# Altium schematic sheet ESP32_with_USBC.SchDoc
size A2; SheetNumber: 1; SheetTotal: 1
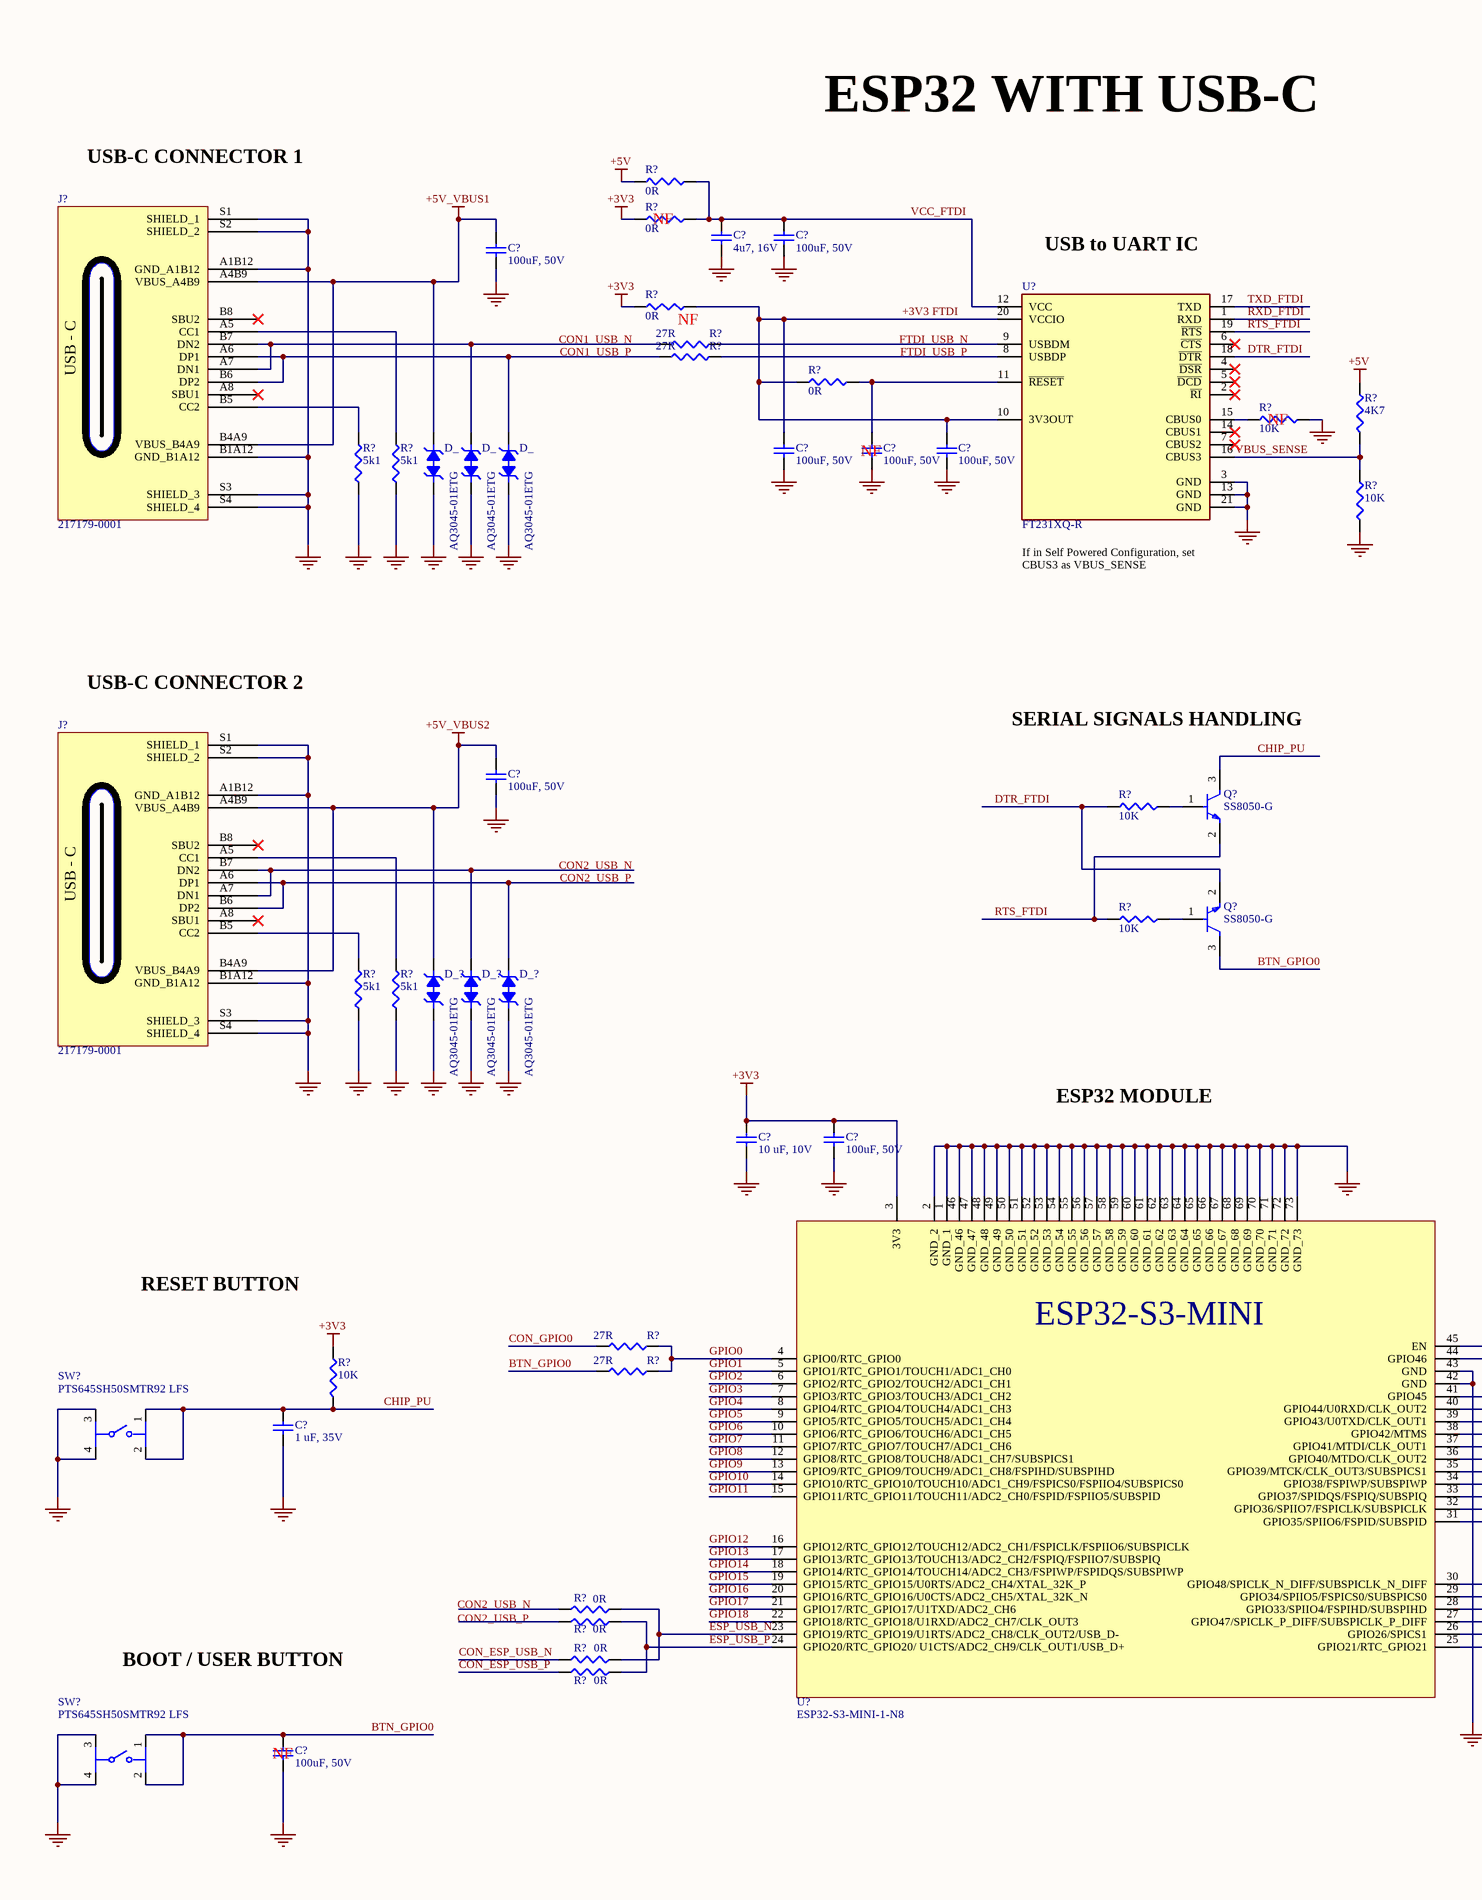
[diagram p0: ESP32_with_USBC.SchDoc, left]
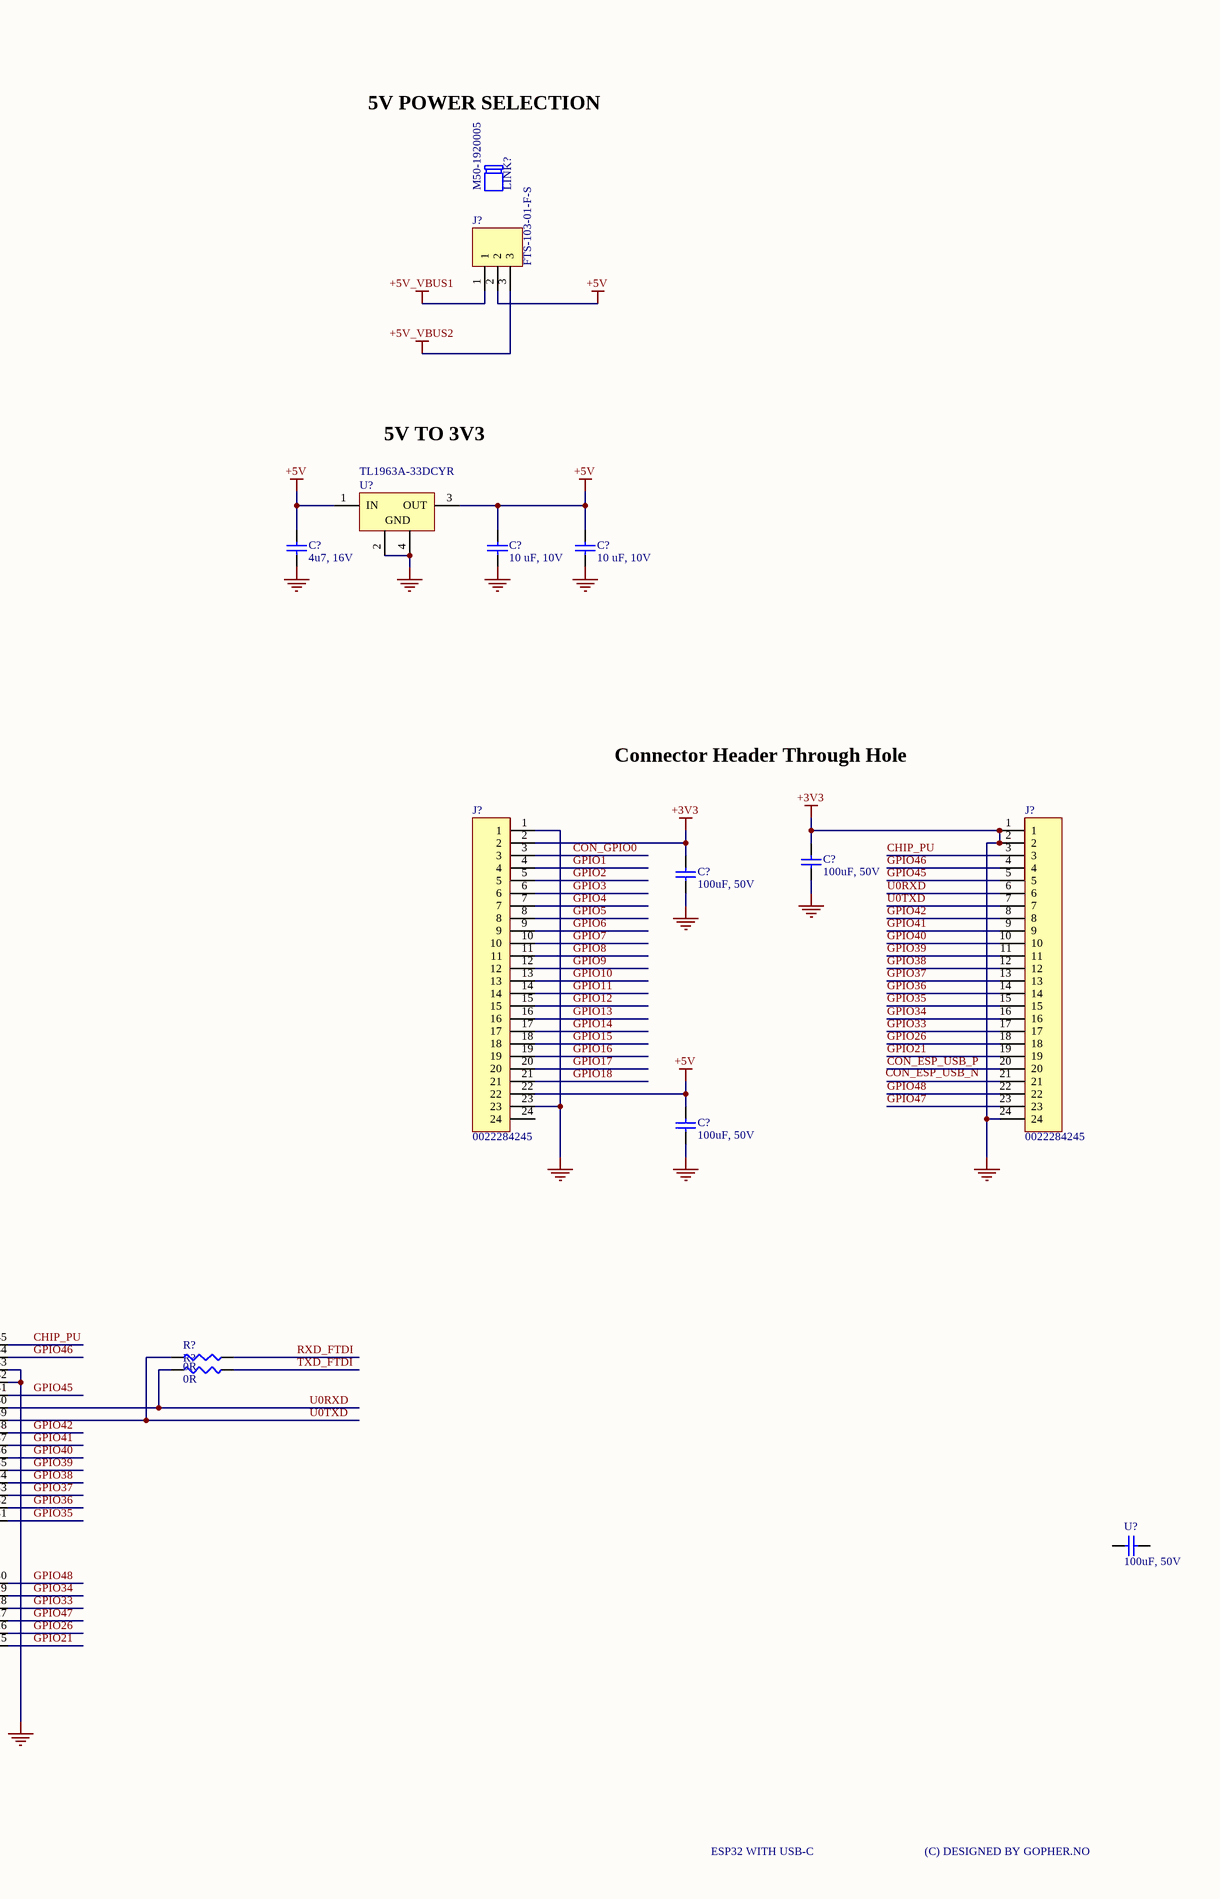
[diagram p1: ESP32_with_USBC.SchDoc, right]

## Parts
(Parts that share a designator on the sheet are numbered #1, #2 ... from top to bottom, then left to right.)
C?#1  4u7, 16V
C?#2  100uF, 50V
C?#3  100uF, 50V
C?#4  100uF, 50V
C?#5  100uF, 50V
C?#6  100uF, 50V
C?#7  4u7, 16V
C?#8  10 uF, 10V
C?#9  10 uF, 10V
C?#10  100uF, 50V
C?#11  100uF, 50V
C?#12  100uF, 50V
C?#13  100uF, 50V
C?#14  10 uF, 10V
C?#15  100uF, 50V
C?#16  1 uF, 35V
C?#17  100uF, 50V
D_#1  AQ3045-01ETG
D_#2  AQ3045-01ETG
D_#3  AQ3045-01ETG
D_?#1  AQ3045-01ETG
D_?#2  AQ3045-01ETG
D_?#3  AQ3045-01ETG
J?#1  217179-0001
J?#2  FTS-103-01-F-S
J?#3  217179-0001
J?#4  0022284245
J?#5  0022284245
LINK?  M50-1920005
Q?#1  SS8050-G
Q?#2  SS8050-G
R?#1  0R
R?#2  0R
R?#3  0R
R?#4  27R
R?#5  27R
R?#6  0R
R?#7  10K
R?#8  4K7
R?#9  5k1
R?#10  5k1
R?#11  10K
R?#12  10K
R?#13  10K
R?#14  5k1
R?#15  5k1
R?#16  10K
R?#17  27R
R?#18  0R
R?#19  27R
R?#20  0R
R?#21  0R
R?#22  0R
R?#23  0R
R?#24  0R
SW?#1  PTS645SH50SMTR92 LFS
SW?#2  PTS645SH50SMTR92 LFS
U?#1  FT231XQ-R
U?#2  TL1963A-33DCYR
U?#3  ESP32-S3-MINI-1-N8
U?#4  100uF, 50V

## Nets
+3V3: C?#1.1 C?#2.1 C?#3.1 C?#4.1 C?#5.1 C?#6.1 C?#7.1 C?#8.1 C?#9.1 C?#10.1 C?#11.1 C?#12.1 C?#13.1 C?#14.1 C?#14.2 C?#15.1 C?#16.2 C?#17.1 D_#1.2 D_#2.1 D_#3.1 D_?#1.2 D_?#2.1 D_?#3.1 J?#1.A1B12(GND_A1B12) J?#1.B1A12(GND_B1A12) J?#1.S1(SHIELD_1) J?#1.S2(SHIELD_2) J?#1.S3(SHIELD_3) J?#1.S4(SHIELD_4) J?#3.A1B12(GND_A1B12) J?#3.B1A12(GND_B1A12) J?#3.S1(SHIELD_1) J?#3.S2(SHIELD_2) J?#3.S3(SHIELD_3) J?#3.S4(SHIELD_4) J?#4.1 J?#4.2 J?#4.23 J?#5.1 J?#5.2 J?#5.24 R?#2.1 R?#3.1 R?#7.1 R?#9.1 R?#10.1 R?#11.1 R?#14.1 R?#15.1 R?#16.1 SW?#1.3 SW?#1.4 SW?#2.3 SW?#2.4 U?#1.3(GND) U?#1.13(GND) U?#1.21(GND) U?#2.2(GND) U?#2.4(GND) U?#3.1(GND_1) U?#3.2(GND_2) U?#3.3(3V3) U?#3.42(GND) U?#3.43(GND) U?#3.46(GND_46) U?#3.47(GND_47) U?#3.48(GND_48) U?#3.49(GND_49) U?#3.50(GND_50) U?#3.51(GND_51) U?#3.52(GND_52) U?#3.53(GND_53) U?#3.54(GND_54) U?#3.55(GND_55) U?#3.56(GND_56) U?#3.57(GND_57) U?#3.58(GND_58) U?#3.59(GND_59) U?#3.60(GND_60) U?#3.61(GND_61) U?#3.62(GND_62) U?#3.63(GND_63) U?#3.64(GND_64) U?#3.65(GND_65) U?#3.66(GND_66) U?#3.67(GND_67) U?#3.68(GND_68) U?#3.69(GND_69) U?#3.70(GND_70) U?#3.71(GND_71) U?#3.72(GND_72) U?#3.73(GND_73)  [also labelled GND]
+5V: C?#7.2 C?#8.2 C?#9.2 C?#13.1 J?#2.2 J?#4.22 R?#1.1 R?#8.2 U?#2.1(IN) U?#2.3(OUT)
+5V_VBUS1: C?#3.1 D_#2.2 J?#1.A4B9(VBUS_A4B9) J?#1.B4A9(VBUS_B4A9) J?#2.1
+5V_VBUS2: C?#10.1 D_?#2.2 J?#2.3 J?#3.A4B9(VBUS_A4B9) J?#3.B4A9(VBUS_B4A9)
+3V3 FTDI: C?#4.1 C?#6.1 R?#3.2 R?#6.1 U?#1.10(3V3OUT) U?#1.20(VCCIO)
BTN_GPIO0: C?#17.1 SW?#2.1 SW?#2.2
CHIP_PU: C?#16.1 J?#5.3 Q?#1.3(C) R?#16.2 SW?#1.1 SW?#1.2 U?#3.45(EN)
CON_ESP_USB_N: R?#23.1
CON_ESP_USB_P: J?#5.20 R?#24.1
DTR_FTDI: Q?#2.2(E) R?#12.1 U?#1.18(~{DTR})
ESP_USB_N: R?#21.2 R?#23.2 U?#3.23(GPIO19/RTC_GPIO19/U1RTS/ADC2_CH8/CLK_OUT2/USB_D-)
ESP_USB_P: R?#22.2 R?#24.2 U?#3.24(GPIO20/RTC_GPIO20/_U1CTS/ADC2_CH9/CLK_OUT1/USB_D+)
GPIO0: R?#17.2 R?#19.2 U?#3.4(GPIO0/RTC_GPIO0)
GPIO1: J?#4.4 U?#3.5(GPIO1/RTC_GPIO1/TOUCH1/ADC1_CH0)
GPIO2: J?#4.5 U?#3.6(GPIO2/RTC_GPIO2/TOUCH2/ADC1_CH1)
GPIO3: J?#4.6 U?#3.7(GPIO3/RTC_GPIO3/TOUCH3/ADC1_CH2)
GPIO4: J?#4.7 U?#3.8(GPIO4/RTC_GPIO4/TOUCH4/ADC1_CH3)
GPIO5: J?#4.8 U?#3.9(GPIO5/RTC_GPIO5/TOUCH5/ADC1_CH4)
GPIO6: J?#4.9 U?#3.10(GPIO6/RTC_GPIO6/TOUCH6/ADC1_CH5)
GPIO7: J?#4.10 U?#3.11(GPIO7/RTC_GPIO7/TOUCH7/ADC1_CH6)
GPIO8: J?#4.11 U?#3.12(GPIO8/RTC_GPIO8/TOUCH8/ADC1_CH7/SUBSPICS1)
GPIO9: J?#4.12 U?#3.13(GPIO9/RTC_GPIO9/TOUCH9/ADC1_CH8/FSPIHD/SUBSPIHD)
GPIO10: J?#4.13 U?#3.14(GPIO10/RTC_GPIO10/TOUCH10/ADC1_CH9/FSPICS0/FSPIIO4/SUBSPICS0)
GPIO11: J?#4.14 U?#3.15(GPIO11/RTC_GPIO11/TOUCH11/ADC2_CH0/FSPID/FSPIIO5/SUBSPID)
GPIO12: J?#4.15 U?#3.16(GPIO12/RTC_GPIO12/TOUCH12/ADC2_CH1/FSPICLK/FSPIIO6/SUBSPICLK)
GPIO13: J?#4.16 U?#3.17(GPIO13/RTC_GPIO13/TOUCH13/ADC2_CH2/FSPIQ/FSPIIO7/SUBSPIQ)
GPIO14: J?#4.17 U?#3.18(GPIO14/RTC_GPIO14/TOUCH14/ADC2_CH3/FSPIWP/FSPIDQS/SUBSPIWP)
GPIO15: J?#4.18 U?#3.19(GPIO15/RTC_GPIO15/U0RTS/ADC2_CH4/XTAL_32K_P)
GPIO16: J?#4.19 U?#3.20(GPIO16/RTC_GPIO16/U0CTS/ADC2_CH5/XTAL_32K_N)
GPIO17: J?#4.20 U?#3.21(GPIO17/RTC_GPIO17/U1TXD/ADC2_CH6)
GPIO18: J?#4.21 U?#3.22(GPIO18/RTC_GPIO18/U1RXD/ADC2_CH7/CLK_OUT3)
GPIO21: J?#5.19 U?#3.25(GPIO21/RTC_GPIO21)
GPIO26: J?#5.18 U?#3.26(GPIO26/SPICS1)
GPIO33: J?#5.17 U?#3.28(GPIO33/SPIIO4/FSPIHD/SUBSPIHD)
GPIO34: J?#5.16 U?#3.29(GPIO34/SPIIO5/FSPICS0/SUBSPICS0)
GPIO35: J?#5.15 U?#3.31(GPIO35/SPIIO6/FSPID/SUBSPID)
GPIO36: J?#5.14 U?#3.32(GPIO36/SPIIO7/FSPICLK/SUBSPICLK)
GPIO37: J?#5.13 U?#3.33(GPIO37/SPIDQS/FSPIQ/SUBSPIQ)
GPIO38: J?#5.12 U?#3.34(GPIO38/FSPIWP/SUBSPIWP)
GPIO39: J?#5.11 U?#3.35(GPIO39/MTCK/CLK_OUT3/SUBSPICS1)
GPIO40: J?#5.10 U?#3.36(GPIO40/MTDO/CLK_OUT2)
GPIO41: J?#5.9 U?#3.37(GPIO41/MTDI/CLK_OUT1)
GPIO42: J?#5.8 U?#3.38(GPIO42/MTMS)
GPIO45: J?#5.5 U?#3.41(GPIO45)
GPIO46: J?#5.4 U?#3.44(GPIO46)
GPIO47: J?#5.23 U?#3.27(GPIO47/SPICLK_P_DIFF/SUBSPICLK_P_DIFF)
GPIO48: J?#5.22 U?#3.30(GPIO48/SPICLK_N_DIFF/SUBSPICLK_N_DIFF)
RTS_FTDI: Q?#1.2(E) R?#13.1 U?#1.19(~{RTS})
RXD_FTDI: R?#18.2 U?#1.1(RXD)
TXD_FTDI: R?#20.2 U?#1.17(TXD)
U0RXD: J?#5.6 R?#20.1 U?#3.40(GPIO44/U0RXD/CLK_OUT2)
U0TXD: J?#5.7 R?#18.1 U?#3.39(GPIO43/U0TXD/CLK_OUT1)
VBUS_SENSE: R?#8.1 R?#11.2 U?#1.16(CBUS3)
NetC?#1_2: C?#1.2 C?#2.1 R?#1.2 R?#2.2 U?#1.12(VCC)
NetC?#5_1: C?#5.1 R?#6.2 U?#1.11(~{RESET})
NetD_#1_1: D_#1.1 J?#1.A7(DN1) J?#1.B7(DN2) R?#4.1
NetD_#3_2: D_#3.2 J?#1.A6(DP1) J?#1.B6(DP2) R?#5.1
NetD_?#1_1: D_?#1.1 J?#3.A7(DN1) J?#3.B7(DN2)
NetD_?#3_2: D_?#3.2 J?#3.A6(DP1) J?#3.B6(DP2)
NetJ?#1_A5: J?#1.A5(CC1) R?#10.2
NetJ?#1_B5: J?#1.B5(CC2) R?#9.2
NetJ?#3_A5: J?#3.A5(CC1) R?#15.2
NetJ?#3_B5: J?#3.B5(CC2) R?#14.2
NetQ?#1_1: Q?#1.1(B) R?#12.2
NetQ?#2_1: Q?#2.1(B) R?#13.2
NetR?#4_2: R?#4.2 U?#1.9(USBDM)
NetR?#5_2: R?#5.2 U?#1.8(USBDP)
NetR?#7_2: R?#7.2 U?#1.15(CBUS0)

Not connected (* = marked no-connect by the designer): J?#1 A8(SBU1)* B8(SBU2)*; J?#3 A8(SBU1)* B8(SBU2)*; J?#4 3 24; J?#5 21; Q?#2 3(C); R?#17 1; R?#19 1; R?#21 1; R?#22 1; U?#1 2(~{RI})* 4(~{DSR})* 5(~{DCD})* 6(~{CTS})* 7(CBUS2)* 14(CBUS1)*; U?#4 1

## Notes on the sheet
- ESP32 WITH USB-C
- 5V POWER SELECTION
- USB-C CONNECTOR 1
- (near R?#2) NF
- USB to UART IC
- (near R?#3) CON1_USB_N
- (near R?#3) CON1_USB_P
- (near R?#3) NF
- FTDI_USB_N
- FTDI_USB_P
- (near R?#7) NF
- 5V TO 3V3
- (near C?#5) NF
- (near U?#1) If in Self Powered Configuration, set CBUS3 as VBUS_SENSE
- USB-C CONNECTOR 2
- SERIAL SIGNALS HANDLING
- Connector Header Through Hole
- CON2_USB_N
- CON2_USB_P
- CON_GPIO0
- (near Q?#2) BTN_GPIO0
- ESP32 MODULE
- RESET BUTTON
- (near R?#17) CON_GPIO0
- (near R?#19) BTN_GPIO0
- (near R?#22) CON2_USB_P
- (near R?#21) CON2_USB_N
- BOOT / USER BUTTON
- (near C?#17) NF
- (C) DESIGNED BY GOPHER.NO
- Labels drawn without touching a wire or pin: CON_ESP_USB_N, VCC_FTDI
- (in symbol 217179-0001) USB - C
- (in symbol ESP32-S3-MINI-1-N8) ESP32-S3-MINI

## Library data of the parts
C?#1 C?#7 = CC0402MRX5R7BB475: Ceramic Capacitor, Multilayer, Ceramic, 16V, 20% +Tol, 20% -Tol, X5R, 15% TC, 4.7uF, Surface Mount, 0402, 4.7 µF ±20% 16V Ceramic Capacitor X5R 0402 (1005 Metric),13-CC0402MRX5R7BB475CT-ND; Manufacturer: Yageo; Multilayer: Yes; Supplier: Digikey; Supplier Part Number: 13-CC0402MRX5R7BB475CT-ND; Manufacturer Part Number: CC0402MRX5R7BB475; RoHS: Yes; Category: Ceramic Capacitors; Stock: 23634; Pricing: 1=0,5, 10=0,303, 100=0,1868, 1000=0,15196, 2500=0,1316, 5000=0,13053 (USD); Mounting Technology: Surface Mount; Pins: 2; Dielectric Material: Ceramic; Package Shape: Rectangular; Case/Package: 0402; Terminal Finish: Tin; Min Operating Temperature: -55°C; Max Operating Temperature: 85°C; JESD-609 Code: e3; Value: 4.7uF; Capacitor Type: Ceramic; Tolerance  (fill in as +-): 20%; Packaging: Tape and Reel; Tolerance (fill in as +-): 20%; Rated DC Voltage (URdc): 16V; Temperature Characteristics Code: X5R; Termination: Wraparound; Reach SVHC Compliant: Yes; RoHS Compliant: Yes; ComponentLink1URL: https://datasheet.ciiva.com:443/pdfs/VipMasterIC/IC/YAGO/YAGO-S-A0006851646/YAGO-S-A0006851646-1.pdf?src-supplier=IHS+Markit; ComponentLink1Description: https://datasheet.ciiva.com:443/pdfs/VipMasterIC/IC/YAGO/YAGO-S-A0006851646/YAGO-S-A0006851646-1.pdf?src-supplier=IHS+Markit; ComponentLink2URL: https://www.mouser.com/ds/2/447/UPY-GPHC_X5R_4V-to-50V_25-1131599.pdf?src-supplier=Mouser; ComponentLink2Description: https://www.mouser.com/ds/2/447/UPY-GPHC_X5R_4V-to-50V_25-1131599.pdf?src-supplier=Mouser; ComponentLink3URL: http://www.yageo.com/documents/recent/UPY-GPHC_X5R_4V-to-50V_25.pdf?src-supplier=Digikey; ComponentLink3Description: http://www.yageo.com/documents/recent/UPY-GPHC_X5R_4V-to-50V_25.pdf?src-supplier=Digikey; ComponentLink4URL: https://www.yageo.com/upload/media/product/productsearch/datasheet/mlcc/UPY-GPHC_X5R_4V-to-50V_26.pdf?src-supplier=Digikey; ComponentLink4Description: https://www.yageo.com/upload/media/product/productsearch/datasheet/mlcc/UPY-GPHC_X5R_4V-to-50V_26.pdf?src-supplier=Digikey; LCSC Part Number: C723999
C?#2-C?#6 C?#10-C?#13 C?#15 C?#17 U?#4 = GCM155R71H104KE02D: Ceramic Capacitor, Ceramic, 50V, 10% +Tol, 10% -Tol, X7R, 15% TC, 0.1uF, Surface Mount, 0402, CAP CER 0.1UF 50V X7R 0402; Manufacturer: Murata; Value: 100nF; Multilayer: Yes; Reference Standard: AEC-Q200; Supplier: Digikey; Supplier Part Number: 490-10672-1-ND; Manufacturer Part Number: GCM155R71H104KE02D; RoHS: Yes; Category: Ceramic Capacitors; Stock: 712609; Pricing: 1=0,1, 10=0,027, 100=0,0166, 1000=0,01117, 2500=0,00972, 5000=0,00881 (USD); Mounting Technology: Surface Mount; Pins: 2; Dielectric Material: Ceramic; Package Shape: Rectangular; Case/Package: 0402; Terminal Finish: Nickel; Min Operating Temperature: -55°C; Max Operating Temperature: 125°C; JESD-609 Code: e3; Capacitor Type: Ceramic; Tolerance  (fill in as +-): 10%; Package Style: SMTMeter; Packaging: Tape and Reel; Tolerance (fill in as +-): 10%; Rated DC Voltage (URdc): 50V; Temperature Characteristics Code: X7R; Termination: Wraparound; Length: 1mm; Width: 0.5mm; Height: 0.55mm; Reach SVHC Compliant: Yes; RoHS Compliant: Yes; ComponentLink1URL: https://datasheet.ciiva.com:443/pdfs/VipMasterIC/IC/MURE/MURE-S-A0004370842/MURE-S-A0004373200-1.pdf?src-supplier=IHS+Markit; ComponentLink1Description: https://datasheet.ciiva.com:443/pdfs/VipMasterIC/IC/MURE/MURE-S-A0004370842/MURE-S-A0004373200-1.pdf?src-supplier=IHS+Markit; ComponentLink2URL: http://www.farnell.com/datasheets/2079122.pdf?src-supplier=Farnell; ComponentLink2Description: http://www.farnell.com/datasheets/2079122.pdf?src-supplier=Farnell; ComponentLink3URL: http://www.mouser.com/ds/2/281/c03e-806517.pdf?src-supplier=Mouser; ComponentLink3Description: http://www.mouser.com/ds/2/281/c03e-806517.pdf?src-supplier=Mouser; ComponentLink4URL: http://www.farnell.com/datasheets/2079122.pdf?src-supplier=Element14; ComponentLink4Description: http://www.farnell.com/datasheets/2079122.pdf?src-supplier=Element14; ComponentLink5URL: https://datasheet.octopart.com/GCM155R71H104KE02D-Murata-datasheet-66077033.pdf?src-supplier=Element14; ComponentLink5Description: https://datasheet.octopart.com/GCM155R71H104KE02D-Murata-datasheet-66077033.pdf?src-supplier=Element14; ComponentLink6URL: http://search.murata.co.jp/Ceramy/image/img/A01X/partnumbering_e_02.pdf?src-supplier=Digikey; ComponentLink6Description: http://search.murata.co.jp/Ceramy/image/img/A01X/partnumbering_e_02.pdf?src-supplier=Digikey; LCSC Part Number: C85858
C?#8 C?#9 C?#14 = CL05A106MP8NUB8: Ceramic Capacitor, Multilayer, Ceramic, 10V, 20% +Tol, 20% -Tol, X5R, 15% TC, 10uF, Surface Mount, 0402, CAP CER 10UF 10V X5R 0402; Manufacturer: Samsung; Multilayer: Yes; Supplier: Digikey; Supplier Part Number: 1276-6830-1-ND; Manufacturer Part Number: CL05A106MP8NUB8; RoHS: Yes; Category: Ceramic Capacitors; Stock: 35446; Pricing: 1=0,25, 10=0,15, 100=0,1008, 1000=0,0704, 2500=0,0576 (USD); Mounting Technology: Surface Mount; Pins: 2; Dielectric Material: Ceramic; Package Shape: Rectangular; Case/Package: 0402; Terminal Finish: Nickel; Min Operating Temperature: -55°C; Max Operating Temperature: 85°C; JESD-609 Code: e3; Value: 10uF; Capacitor Type: Ceramic; Tolerance  (fill in as +-): 20%; Packaging: Tape and Reel; Tolerance (fill in as +-): 20%; Rated DC Voltage (URdc): 10V; Temperature Characteristics Code: X5R; Termination: Wraparound; Reach SVHC Compliant: Yes; RoHS Compliant: Yes; ComponentLink1URL: https://datasheet.ciiva.com:443/pdfs/VipMasterIC/IC/SEMS/SEMS-S-A0008521219/SEMS-S-A0008521325-1.pdf?src-supplier=IHS+Markit; ComponentLink1Description: https://datasheet.ciiva.com:443/pdfs/VipMasterIC/IC/SEMS/SEMS-S-A0008521219/SEMS-S-A0008521325-1.pdf?src-supplier=IHS+Markit; ComponentLink2URL: http://www.samsungsem.com/kr/support/product-search/mlcc/CL05A106MP8NUB8.jsp?src-supplier=Digikey; ComponentLink2Description: http://www.samsungsem.com/kr/support/product-search/mlcc/CL05A106MP8NUB8.jsp?src-supplier=Digikey; ComponentLink3URL: https://datasheet.octopart.com/CL05A106MP8NUB8-Samsung-Electro-Mechanics-datasheet-136460857.pdf?src-supplier=Future+Electronics; ComponentLink3Description: https://datasheet.octopart.com/CL05A106MP8NUB8-Samsung-Electro-Mechanics-datasheet-136460857.pdf?src-supplier=Future+Electronics; LCSC Part Number: C307415
C?#16 = CL05A105KL5NRNC: Ceramic Capacitor, Multilayer, Ceramic, 35V, 10% +Tol, 10% -Tol, X5R, 15% TC, 1uF, Surface Mount, 0402, CAP CER 1UF 35V X5R 0402; Manufacturer: Samsung; Multilayer: Yes; Supplier: Digikey; Supplier Part Number: 1276-6796-1-ND; Manufacturer Part Number: CL05A105KL5NRNC; RoHS: Yes; Category: Ceramic Capacitors; Stock: 194941; Pricing: 1=0,29, 10=0,17, 100=0,1097, 1000=0,07829, 2500=0,06853, 5000=0,06578 (USD); Mounting Technology: Surface Mount; Pins: 2; Dielectric Material: Ceramic; Package Shape: Rectangular; Case/Package: 0402; Terminal Finish: Nickel; Min Operating Temperature: -55°C; Max Operating Temperature: 85°C; JESD-609 Code: e3; Value: 1uF; Capacitor Type: Ceramic; Tolerance  (fill in as +-): 10%; Packaging: Tape and Reel; Tolerance (fill in as +-): 10%; Rated DC Voltage (URdc): 35V; Temperature Characteristics Code: X5R; Termination: Wraparound; Reach SVHC Compliant: Yes; RoHS Compliant: Yes; ComponentLink1URL: https://datasheet.ciiva.com:443/pdfs/VipMasterIC/IC/SEMS/SEMS-S-A0008384515/SEMS-S-A0008872905-1.pdf?src-supplier=IHS+Markit; ComponentLink1Description: https://datasheet.ciiva.com:443/pdfs/VipMasterIC/IC/SEMS/SEMS-S-A0008384515/SEMS-S-A0008872905-1.pdf?src-supplier=IHS+Markit; ComponentLink2URL: http://www.samsungsem.com/kr/support/product-search/mlcc/CL05A105KL5NRNC.jsp?src-supplier=Digikey; ComponentLink2Description: http://www.samsungsem.com/kr/support/product-search/mlcc/CL05A105KL5NRNC.jsp?src-supplier=Digikey; LCSC Part Number: C307413
D_#1-D_#3 D_?#1-D_?#3 = AQ3045-01ETG: Trans Voltage Suppressor Diode, 40W, 5.3V V(RWM), Bidirectional, 1 Element, Silicon, MO-236, TVS DIODE 5.3VWM 12VC SOD882g; Manufacturer: Littelfuse; Package Body Material: Plastic; Max Breakdown Voltage: 9V; Min Breakdown Voltage: 6.8V; Number of Elements: 1; Reference Standard: AEC-Q101; Supplier: Digikey; Supplier Part Number: F9321CT-ND; Manufacturer Part Number: AQ3045-01ETG; RoHS: Yes; Category: TVS Diodes; Stock: 12011; Pricing: 1=0,46, 10=0,302, 100=0,141, 500=0,134, 1000=0,127, 2000=0,1255, 5000=0,124 (USD); Pins: 2; Diode Element Material: SILICON; Package Shape: Rectangular; Min Operating Temperature: -55°C; Max Operating Temperature: 150°C; Polarity: Bidirectional; Diode Type: TRANS VOLTAGE SUPPRESSOR; Non-rep Peak Rev Power Dis-Max: 40W; Package Style: CHIP CARRIERMeter; Rep Pk Reverse Voltage-Max: 5.3V; Surface Mount: Yes; Technology: AVALANCHE; Terminal Form: No Lead; Terminal Position: BOTTOM; Reach SVHC Compliant: Yes; RoHS Compliant: Yes; ComponentLink1URL: https://datasheet.ciiva.com:443/pdfs/VipMasterIC/IC/LFSI/LFSI-S-A0007892042/LFSI-S-A0007892042-1.pdf?src-supplier=IHS+Markit; ComponentLink1Description: https://datasheet.ciiva.com:443/pdfs/VipMasterIC/IC/LFSI/LFSI-S-A0007892042/LFSI-S-A0007892042-1.pdf?src-supplier=IHS+Markit; ComponentLink2URL: https://www.littelfuse.com/~/media/electronics/datasheets/tvs_diode_arrays/littelfuse_tvs_diode_array_aq3045_datasheet.pdf.pdf?src-supplier=Digikey; ComponentLink2Description: https://www.littelfuse.com/~/media/electronics/datasheets/tvs_diode_arrays/littelfuse_tvs_diode_array_aq3045_datasheet.pdf.pdf?src-supplier=Digikey; ComponentLink3URL: http://www.littelfuse.com/~/media/electronics/datasheets/tvs_diode_arrays/littelfuse_tvs_diode_array_aq3045_datasheet.pdf.pdf?src-supplier=Digikey; ComponentLink3Description: http://www.littelfuse.com/~/media/electronics/datasheets/tvs_diode_arrays/littelfuse_tvs_diode_array_aq3045_datasheet.pdf.pdf?src-supplier=Digikey; LCSC Part Number: C3710326
J?#1 J?#3 = 217179-0001: USB Connector, 16 Contact(s), Female, Right Angle, Surface Mount Terminal, Locking, Receptacle, CONN RCP USB2.0 TYP C 24P SMD RA; Manufacturer: Molex; Supplier: Digikey; Supplier Part Number: 900-2171790001CT-ND; Manufacturer Part Number: 217179-0001; RoHS: No; Category: Connectors; Stock: 522; Pricing: 1=0,79, 10=0,645, 25=0,5948, 50=0,5594, 100=0,5259, 250=0,48484, 500=0,45592 (USD); LCSC Part Number: C3197684
J?#2 = FTS-103-01-F-S: Board Connector, 3 Contact(s), 1 Row(s), Male, Straight, Solder Terminal, CONN HEADER VERT 3POS 1.27MM; Manufacturer: Samtec; Manufacturer Series: FTS; Option: General Purpose; Additional Feature: Low Profile; Filter Feature: No; Number of Rows Loaded: 1; Number of Contacts: 3; Supplier: Digikey; Supplier Part Number: 612-FTS-103-01-F-S-ND; Manufacturer Part Number: FTS-103-01-F-S; RoHS: Yes; Category: Connectors; Stock: 1829; Pricing: 1=0,73, 50=0,6378, 100=0,5407, 500=0,4491, 1000=0,38362, 2000=0,31431, 5000=0,2478, 10000=0,228 (USD); Mounting Technology: Board; Contact Material: Bronze; Contact Finish - Mating: GOLD (3) OVER NICKEL (50); Contact Finish - Termination: Matte Tin (Sn) - with Nickel (Ni) barrier; Connector Type: BOARD CONNECTOR; JESD-609 Code: e3; Contact Gender: Male; Mixed Contacts: No; Mounting Style: STRAIGHT; Termination: Solder; Terminal Pitch: 1.27mm; Flammability Rating: UL94 V-0; DIN Conformance: No; IEC Conformance: No; MIL Conformance: No; Reach SVHC Compliant: Yes; RoHS Compliant: Yes; ComponentLink1URL: https://datasheet.ciiva.com:443/pdfs/VipMasterIC/IC/SAMI/SAMI-S-A0001504673/SAMI-S-A0001504673-1.pdf?src-supplier=IHS+Markit; ComponentLink1Description: https://datasheet.ciiva.com:443/pdfs/VipMasterIC/IC/SAMI/SAMI-S-A0001504673/SAMI-S-A0001504673-1.pdf?src-supplier=IHS+Markit; ComponentLink2URL: http://suddendocs.samtec.com/prints/fts-1xx-xx-xx-xx-xx-mkt.pdf?src-supplier=Digikey; ComponentLink2Description: http://suddendocs.samtec.com/prints/fts-1xx-xx-xx-xx-xx-mkt.pdf?src-supplier=Digikey; ComponentLink3URL: http://www.samtec.com/documents/webfiles/pdf/FTS.pdf?src-supplier=Avnet; ComponentLink3Description: http://www.samtec.com/documents/webfiles/pdf/FTS.pdf?src-supplier=Avnet; ComponentLink4URL: https://datasheet.octopart.com/FTS-103-01-F-S-Samtec-datasheet-116535195.pdf?src-supplier=Toby+Electronics; ComponentLink4Description: https://datasheet.octopart.com/FTS-103-01-F-S-Samtec-datasheet-116535195.pdf?src-supplier=Toby+Electronics; ComponentLink5URL: https://datasheet.octopart.com/FTS-103-01-F-S-Samtec-datasheet-151470456.pdf?src-supplier=Sager+Electronics; ComponentLink5Description: https://datasheet.octopart.com/FTS-103-01-F-S-Samtec-datasheet-151470456.pdf?src-supplier=Sager+Electronics; LCSC Part Number: C3333578
J?#4 J?#5 = 22-28-4245: Connector Header Through Hole 24 position 0.100" (2.54mm); Manufacturer: Molex; Supplier: Digikey; Supplier Part Number: 900-0022284245-ND; Manufacturer Part Number: 22-28-4245; RoHS: No; Category: Headers and Wire Housings; Stock: 2584; Pricing: 1=1,21, 10=1,024, 100=0,8699, 500=0,77638, 1000=0,73932, 5000=0,65998, 10000=0,62851 (USD); ComponentLink1URL: https://datasheet.ciiva.com/6814/022284363-sd-6814049.pdf?src-supplier=Digikey; ComponentLink1Description: https://datasheet.ciiva.com/6814/022284363-sd-6814049.pdf?src-supplier=Digikey; ComponentLink2URL: https://datasheet.ciiva.com/10075/0022284245-pcb-headers-10075617.pdf?src-supplier=Avnet; ComponentLink2Description: https://datasheet.ciiva.com/10075/0022284245-pcb-headers-10075617.pdf?src-supplier=Avnet; ComponentLink3URL: https://datasheet.ciiva.com/1433/1597854-1433759.pdf?src-supplier=Element14; ComponentLink3Description: https://datasheet.ciiva.com/1433/1597854-1433759.pdf?src-supplier=Element14; LCSC Part Number: C7145888
LINK? = M50-1920005: Interconnection Device, 2 (1 x 2) Position Shunt Connector Red Closed Top 0.050" (1.27mm) Gold; Manufacturer: Harwin; Manufacturer Series: M50; Body/Shell Style: PLUG; Contact Pattern: RECTANGULAR; Contact Resistance: 20mR; Dielectric Withstanding Voltage (AC): 500V; Durability: 300Cycles; Insulation Resistance: 1GR; Number Of Connectors: 1; Rated Current (Signal): 1A; Number of Contacts: 2; Body Breadth: 0.059inch; Body Depth: 0.118inch; Body Length: 0.098inch; Mating Contact Pitch: 0.05inch; Reference Standard: UL; Reliability: COMMERCIAL; Supplier: Digikey; Supplier Part Number: 952-1727-ND; Manufacturer Part Number: M50-1920005; RoHS: Yes; Category: Headers and Wire Housings; Stock: 2168; Pricing: 1=0,33, 10=0,284, 25=0,2664, 50=0,2536, 100=0,2414, 250=0,22628, 500=0,21546, 1000=0,20516, 3000=0,18984 (USD); Contact Material: Copper Alloy; Contact Finish - Mating: AU ON NI; Contact Finish - Termination: Gold (Au); Insulation Color: Red; Insulation Material: Nylon; Min Operating Temperature: -40°C; Max Operating Temperature: 105°C; Connector Type: Interconnection Device; JESD-609 Code: e4; Contact Gender: Female; Mounting Style: STRAIGHT; Number of Rows Loaded: 1; Reach SVHC Compliant: Yes; RoHS Compliant: Yes; ComponentLink1URL: https://datasheet.ciiva.com:443/pdfs/VipMasterIC/IC/HRWN/HRWNS04645/HRWNS04645-1.pdf?src-supplier=IHS+Markit; ComponentLink1Description: https://datasheet.ciiva.com:443/pdfs/VipMasterIC/IC/HRWN/HRWNS04645/HRWNS04645-1.pdf?src-supplier=IHS+Markit; ComponentLink2URL: https://datasheet.ciiva.com/4573/m50-19x-350826-4573042.pdf?src-supplier=Mouser; ComponentLink2Description: https://datasheet.ciiva.com/4573/m50-19x-350826-4573042.pdf?src-supplier=Mouser; ComponentLink3URL: https://datasheet.ciiva.com/767/m50-19x-767921.pdf?src-supplier=Digikey; ComponentLink3Description: https://datasheet.ciiva.com/767/m50-19x-767921.pdf?src-supplier=Digikey; ComponentLink4URL: https://datasheet.ciiva.com/1456/m50-19x-1456640.pdf?src-supplier=Newark; ComponentLink4Description: https://datasheet.ciiva.com/1456/m50-19x-1456640.pdf?src-supplier=Newark; ComponentLink5URL: https://datasheet.ciiva.com/1412/1836978-1412125.pdf?src-supplier=Element14; ComponentLink5Description: https://datasheet.ciiva.com/1412/1836978-1412125.pdf?src-supplier=Element14; LCSC Part Number: C6985646
Q?#1 Q?#2 = SS8050-G: TRANS NPN 25V 1.5A SOT-23-3; Manufacturer: Comchip; Supplier: Digikey; Supplier Part Number: 641-1790-1-ND; Manufacturer Part Number: SS8050-G; RoHS: Yes; Category: Transistors; Stock: 140194; Pricing: 1=0,24, 10=0,148, 100=0,0921, 500=0,06754, 1000=0,05958 (USD); Reach SVHC Compliant: Yes; RoHS Compliant: Yes; ComponentLink1URL: https://datasheet.ciiva.com:443/pdfs/VipMasterIC/IC/COMC/COMC-S-A0004994192/COMC-S-A0004994192-1.pdf?src-supplier=IHS+Markit; ComponentLink1Description: https://datasheet.ciiva.com:443/pdfs/VipMasterIC/IC/COMC/COMC-S-A0004994192/COMC-S-A0004994192-1.pdf?src-supplier=IHS+Markit; ComponentLink2URL: http://www.comchiptech.com/admin/files/product/SS8050-G RevA181526.pdf?src-supplier=Digikey; ComponentLink2Description: http://www.comchiptech.com/admin/files/product/SS8050-G RevA181526.pdf?src-supplier=Digikey; LCSC Part Number: C164886
R?#1-R?#3 R?#6 R?#18 R?#20-R?#24 = RC0402JR-070RL: Metal Glaze/thick Film, 0.0625W, 0ohm, Surface Mount, 0402, 0 Ohms Jumper Chip Resistor 0402 (1005 Metric) Moisture Resistant Thick Film; Manufacturer: Yageo; Power: 62.5mW; Rated Temperature: 70°C; Package Height: 0.35mm; Package Length: 1mm; Package Width: 0.5mm; Supplier: Digikey; Supplier Part Number: 311-0.0JRCT-ND; Manufacturer Part Number: RC0402JR-070RL; RoHS: Yes; Category: Chip SMD Resistors; Stock: 10493285; Pricing: 1=0,1, 10=0,01, 25=0,0064, 50=0,0054, 100=0,0047, 250=0,00392, 500=0,00346, 1000=0,00304, 5000=0,0023 (USD); Mounting Technology: Surface Mount; Pins: 2; Package Shape: Rectangular; Case/Package: 0402; Terminal Finish: Nickel; Min Operating Temperature: -55°C; Max Operating Temperature: 155°C; JESD-609 Code: e3; Resistor Type: FIXED RESISTOR; Construction: Chip; Packaging: Tape and Reel; Value: 0R; Technology: METAL GLAZE/THICK FILM; Termination: Wraparound; Reach SVHC Compliant: Yes; RoHS Compliant: Yes; ComponentLink1URL: https://datasheet.ciiva.com:443/pdfs/VipMasterIC/IC/YAGO/YAGO-S-A0008145938/YAGO-S-A0008145938-1.pdf?src-supplier=IHS+Markit; ComponentLink1Description: https://datasheet.ciiva.com:443/pdfs/VipMasterIC/IC/YAGO/YAGO-S-A0008145938/YAGO-S-A0008145938-1.pdf?src-supplier=IHS+Markit; LCSC Part Number: C60485
R?#4 R?#5 R?#17 R?#19 = RC0402FR-0727RL: Fixed Resistor, Metal Glaze/thick Film, 0.0625W, 27ohm, 50V, 1% +/-Tol, 100ppm/Cel, Surface Mount, 0402, RES 27 OHM 1% 1/16W 0402; Manufacturer: Yageo; Additional Feature: LASER TRIMMABLE; Power: 62.5mW; Rated Temperature: 70°C; Temperature Coefficient (ppm/Cel): 100; Package Height: 0.35mm; Package Length: 1mm; Package Width: 0.5mm; Supplier: Digikey; Supplier Part Number: YAG3086CT-ND; Manufacturer Part Number: RC0402FR-0727RL; RoHS: Yes; Category: Chip SMD Resistors; Stock: 430018; Pricing: 1=0,1, 10=0,007, 100=0,0041, 1000=0,00357, 2500=0,00306 (USD); Mounting Technology: Surface Mount; Pins: 2; Package Shape: Rectangular; Case/Package: 0402; Terminal Finish: Nickel; Min Operating Temperature: -55°C; Max Operating Temperature: 155°C; Tolerance: 1%; JESD-609 Code: e3; Resistor Type: FIXED RESISTOR; Construction: Chip; Packaging: Tape and Reel; Value: 27R; Technology: METAL GLAZE/THICK FILM; Termination: Wraparound; Working Voltage: 50V; Reach SVHC Compliant: Yes; RoHS Compliant: Yes; ComponentLink1URL: https://datasheet.ciiva.com:443/pdfs/VipMasterIC/IC/YAGO/YAGO-S-A0008145938/YAGO-S-A0008145938-1.pdf?src-supplier=IHS+Markit; ComponentLink1Description: https://datasheet.ciiva.com:443/pdfs/VipMasterIC/IC/YAGO/YAGO-S-A0008145938/YAGO-S-A0008145938-1.pdf?src-supplier=IHS+Markit; ComponentLink2URL: https://datasheet.ciiva.com/11808/0900766b80c66297-11808450.pdf?src-supplier=Rs; ComponentLink2Description: https://datasheet.ciiva.com/11808/0900766b80c66297-11808450.pdf?src-supplier=Rs; ComponentLink3URL: https://datasheet.ciiva.com/7849/1018594-7849927.pdf?src-supplier=Element14; ComponentLink3Description: https://datasheet.ciiva.com/7849/1018594-7849927.pdf?src-supplier=Element14; ComponentLink4URL: https://datasheet.ciiva.com/7849/1018594-7849926.pdf?src-supplier=Element14; ComponentLink4Description: https://datasheet.ciiva.com/7849/1018594-7849926.pdf?src-supplier=Element14; ComponentLink5URL: https://datasheet.ciiva.com/17044/pyu-rc0402-51-rohs-l-6-17044345.pdf?src-supplier=Future+Electronics; ComponentLink5Description: https://datasheet.ciiva.com/17044/pyu-rc0402-51-rohs-l-6-17044345.pdf?src-supplier=Future+Electronics; ComponentLink6URL: https://datasheet.ciiva.com/15189/getdatasheetpartid-327852-15189402.pdf?src-supplier=Verical; ComponentLink6Description: https://datasheet.ciiva.com/15189/getdatasheetpartid-327852-15189402.pdf?src-supplier=Verical; LCSC Part Number: C138021
R?#7 R?#11-R?#13 R?#16 = AC0402FR-0710KL: Fixed Resistor, Metal Glaze/thick Film, 0.0625W, 10000ohm, 50V, 1% +/-Tol, 100ppm/Cel, Surface Mount, 0402, RES SMD 10K OHM 1% 1/16W 0402; Manufacturer: Yageo; Additional Feature: LASER TRIMMABLE; Power: 62.5mW; Rated Temperature: 70°C; Value: 10kR; Temperature Coefficient (ppm/Cel): 100; Package Height: 0.32mm; Package Length: 1mm; Package Width: 0.5mm; Reference Standard: AEC-Q200; Supplier: Digikey; Supplier Part Number: YAG3436CT-ND; Manufacturer Part Number: AC0402FR-0710KL; RoHS: Yes; Category: Chip SMD Resistors; Stock: 815583; Pricing: 1=0,1, 10=0,009, 100=0,0071, 1000=0,0051, 2500=0,00408 (USD); Mounting Technology: Surface Mount; Pins: 2; Package Shape: Rectangular; Case/Package: 0402; Terminal Finish: Nickel; Min Operating Temperature: -55°C; Max Operating Temperature: 155°C; Tolerance: 1%; JESD-609 Code: e3; Resistor Type: FIXED RESISTOR; Construction: Chip; Packaging: Tape and Reel; Technology: METAL GLAZE/THICK FILM; Termination: Wraparound; Working Voltage: 50V; Reach SVHC Compliant: Yes; RoHS Compliant: Yes; ComponentLink1URL: https://datasheet.ciiva.com:443/pdfs/VipMasterIC/IC/YAGO/YAGO-S-A0003597364/YAGO-S-A0003597364-1.pdf?src-supplier=IHS+Markit; ComponentLink1Description: https://datasheet.ciiva.com:443/pdfs/VipMasterIC/IC/YAGO/YAGO-S-A0003597364/YAGO-S-A0003597364-1.pdf?src-supplier=IHS+Markit; ComponentLink2URL: https://datasheet.ciiva.com/12656/pyu-ac-51-rohs-l-2-12656634.pdf?src-supplier=Mouser; ComponentLink2Description: https://datasheet.ciiva.com/12656/pyu-ac-51-rohs-l-2-12656634.pdf?src-supplier=Mouser; LCSC Part Number: C144807
R?#8 = RC0402FR-074K7L: RES 4.7K OHM 1% 1/16W 0402; Manufacturer: Yageo; Additional Feature: LASER TRIMMABLE; Power: 62.5mW; Rated Temperature: 70°C; Value: 4.7kR; Working Voltage: 50V; Temperature Coefficient (ppm/Cel): 100; Package Height: 0.35mm; Package Length: 1mm; Package Width: 0.5mm; Supplier: Digikey; Supplier Part Number: 311-4.7KLRCT-ND; Manufacturer Part Number: RC0402FR-074K7L; RoHS: Yes; Category: Chip SMD Resistors; Stock: 1384980; Pricing: 1=0,1, 10=0,007, 100=0,0061, 1000=0,0051, 2500=0,00408 (USD); Mounting Technology: Surface Mount; Pins: 2; Package Shape: Rectangular; Case/Package: 0402; Terminal Finish: Nickel; Min Operating Temperature: -55°C; Max Operating Temperature: 155°C; Tolerance: 1%; JESD-609 Code: e3; Resistor Type: FIXED RESISTOR; Construction: Chip; Packaging: Tape and Reel; Technology: METAL GLAZE/THICK FILM; Termination: Wraparound; Reach SVHC Compliant: Yes; RoHS Compliant: Yes; ComponentLink1URL: https://datasheet.ciiva.com:443/pdfs/VipMasterIC/IC/YAGO/YAGO-S-A0008145938/YAGO-S-A0008145938-1.pdf?src-supplier=IHS+Markit; ComponentLink1Description: https://datasheet.ciiva.com:443/pdfs/VipMasterIC/IC/YAGO/YAGO-S-A0008145938/YAGO-S-A0008145938-1.pdf?src-supplier=IHS+Markit; ComponentLink2URL: https://datasheet.ciiva.com/22661/1686128-22661342.pdf?src-supplier=Element14; ComponentLink2Description: https://datasheet.ciiva.com/22661/1686128-22661342.pdf?src-supplier=Element14; ComponentLink3URL: https://datasheet.ciiva.com/7850/1018594-7850022.pdf?src-supplier=Element14; ComponentLink3Description: https://datasheet.ciiva.com/7850/1018594-7850022.pdf?src-supplier=Element14; ComponentLink4URL: https://datasheet.ciiva.com/7850/1018594-7850023.pdf?src-supplier=Element14; ComponentLink4Description: https://datasheet.ciiva.com/7850/1018594-7850023.pdf?src-supplier=Element14; LCSC Part Number: C105871
R?#9 R?#10 R?#14 R?#15 = AC0402FR-075K1L: Fixed Resistor, Metal Glaze/thick Film, 0.0625W, 5100ohm, 50V, 1% +/-Tol, 100ppm/Cel, Surface Mount, 0402, RES SMD 5.1K OHM 1% 1/16W 0402; Manufacturer: Yageo; Additional Feature: LASER TRIMMABLE; Power: 62.5mW; Rated Temperature: 70°C; Value: 5.1kR; Temperature Coefficient (ppm/Cel): 100; Package Height: 0.32mm; Package Length: 1mm; Package Width: 0.5mm; Reference Standard: AEC-Q200; Supplier: Digikey; Supplier Part Number: YAG3503CT-ND; Manufacturer Part Number: AC0402FR-075K1L; RoHS: Yes; Category: Chip SMD Resistors; Stock: 31963; Pricing: 1=0,1, 10=0,009, 100=0,0071, 1000=0,00612, 2500=0,0051 (USD); Mounting Technology: Surface Mount; Pins: 2; Package Shape: Rectangular; Case/Package: 0402; Terminal Finish: Nickel; Min Operating Temperature: -55°C; Max Operating Temperature: 155°C; Tolerance: 1%; JESD-609 Code: e3; Resistor Type: FIXED RESISTOR; Construction: Chip; Packaging: Tape and Reel; Technology: METAL GLAZE/THICK FILM; Termination: Wraparound; Working Voltage: 50V; Reach SVHC Compliant: Yes; RoHS Compliant: Yes; ComponentLink1URL: https://datasheet.ciiva.com:443/pdfs/VipMasterIC/IC/YAGO/YAGO-S-A0003597364/YAGO-S-A0003597364-1.pdf?src-supplier=IHS+Markit; ComponentLink1Description: https://datasheet.ciiva.com:443/pdfs/VipMasterIC/IC/YAGO/YAGO-S-A0003597364/YAGO-S-A0003597364-1.pdf?src-supplier=IHS+Markit; ComponentLink2URL: https://datasheet.octopart.com/AC0402FR-075K1L-Yageo-datasheet-166720450.pdf?src-supplier=Future+Electronics; ComponentLink2Description: https://datasheet.octopart.com/AC0402FR-075K1L-Yageo-datasheet-166720450.pdf?src-supplier=Future+Electronics; ComponentLink3URL: http://www.yageo.com/documents/recent/PYu-AC_51_RoHS_L_2_revised.pdf?src-supplier=Future+Electronics; ComponentLink3Description: http://www.yageo.com/documents/recent/PYu-AC_51_RoHS_L_2_revised.pdf?src-supplier=Future+Electronics; ComponentLink4URL: http://www.yageo.com/NewPortal/yageodocoutput?fileName=/pdf/R-Chip/PYu-AC_51_RoHS_L_6.pdf&src-supplier=Digikey; ComponentLink4Description: http://www.yageo.com/NewPortal/yageodocoutput?fileName=/pdf/R-Chip/PYu-AC_51_RoHS_L_6.pdf&src-supplier=Digikey; LCSC Part Number: C144745
SW?#1 SW?#2 = PTS645SH50SMTR92LFS: Keypad Switch, 1 Switches, SPST, Momentary-tactile, 0.05A, 12VDC, 1.96N, 4 PCB Hole Cnt, Solder Terminal, Surface Mount-straight, SWITCH TACTILE SPST-NO 0.05A 12V; Manufacturer: ITT C&K; Manufacturer Series: PTS645; Actuator Type: Pushbutton; Contact Current(DC)-Max: 50mA; Contact DC Max Rating R Load: 0.05A@12VDC; Contact Resistance: 0.1mR; Dielectric Withstand Volts: 250VACV; Insulation Resistance: 100GR; PCB Hole Count: 4; Body Breadth: 5.9944mm; Body Height: 3.4544mm; Supplier: Digikey; Supplier Part Number: CKN9085CT-ND; Manufacturer Part Number: PTS645SH50SMTR92LFS; RoHS: Yes; Category: Tactile Switches; Stock: 17092; Pricing: 1=0,33, 10=0,285, 25=0,2692, 100=0,2476, 250=0,23404, 500=0,22418 (USD); Mounting Technology: Surface Mount; Terminal Finish: Silver; Min Operating Temperature: -20°C; Max Operating Temperature: 60°C; JESD-609 Code: e4; Contact Voltage(DC)-Max: 12V; Switch Action: MOMENTARY; Switch Function: SPST; Switch Type: Keypad; Termination: Solder; Body Length or Diameter: 5.9944mm; Terminal Length: 0.138inch; Reach SVHC Compliant: Yes; RoHS Compliant: Yes; ComponentLink1URL: https://datasheet.ciiva.com:443/pdfs/VipMasterIC/IC/CKCI/CKCI-S-A0001796527/CKCI-S-A0001796842-1.pdf?src-supplier=IHS+Markit; ComponentLink1Description: https://datasheet.ciiva.com:443/pdfs/VipMasterIC/IC/CKCI/CKCI-S-A0001796527/CKCI-S-A0001796842-1.pdf?src-supplier=IHS+Markit; ComponentLink2URL: https://datasheet.ciiva.com/29903/getdatasheetpartid-773702-29903807.pdf?src-supplier=Verical; ComponentLink2Description: https://datasheet.ciiva.com/29903/getdatasheetpartid-773702-29903807.pdf?src-supplier=Verical; ComponentLink3URL: https://datasheet.ciiva.com/14920/pts645-14920741.pdf?src-supplier=Digikey; ComponentLink3Description: https://datasheet.ciiva.com/14920/pts645-14920741.pdf?src-supplier=Digikey; ComponentLink4URL: https://datasheet.ciiva.com/22637/1707731-22637356.pdf?src-supplier=Element14; ComponentLink4Description: https://datasheet.ciiva.com/22637/1707731-22637356.pdf?src-supplier=Element14; LCSC Part Number: C221869
U?#1 = FT231XQ-R: Microprocessor Circuit, CMOS, USB Bridge, USB to UART USB 2.0 UART Interface 20-QFN (4x4); Manufacturer: FTDI; Power Supplies: 3.3/5V; Max Supply Current: 8.4mA; Max Supply Voltage: 5.5V; Min Supply Voltage: 2.97V; Nominal Supply Voltage: 5V; Qualification Status: Not Qualified; Supplier: Digikey; Supplier Part Number: 768-1128-1-ND; Manufacturer Part Number: FT231XQ-R; RoHS: Yes; Category: Interface ICs; Stock: 41639; Pricing: 1=2,34, 25=2,27, 100=2,2, 250=2, 500=1,82002, 1000=1,7625 (USD); Case/Package: HVQCCN; Pins: 20; Package Shape: Square; Min Operating Temperature: -40°C; Max Operating Temperature: 85°C; JESD-30 Code: S-XQCC-N20; Package Style: CHIP CARRIER, HEAT SINK/SLUG, VERY THIN PROFILEMeter; Surface Mount: Yes; Technology: CMOS; Terminal Form: No Lead; Terminal Position: QUAD; Length: 4mm; Width: 4mm; Height - Seated (Max): 0.8mm; Terminal Pitch: 0.5mm; Temperature Grade: INDUSTRIAL; Reach SVHC Compliant: Yes; RoHS Compliant: Yes; ComponentLink1URL: https://datasheet.ciiva.com:443/pdfs/VipMasterIC/IC/FTDI/FTDIS00099/FTDIS00099-1.pdf?src-supplier=IHS+Markit; ComponentLink1Description: https://datasheet.ciiva.com:443/pdfs/VipMasterIC/IC/FTDI/FTDIS00099/FTDIS00099-1.pdf?src-supplier=IHS+Markit; ComponentLink2URL: https://datasheet.ciiva.com/1787/ds-ft231x-1787312.pdf?src-supplier=Digikey; ComponentLink2Description: https://datasheet.ciiva.com/1787/ds-ft231x-1787312.pdf?src-supplier=Digikey; ComponentLink3URL: https://datasheet.ciiva.com/4787/ds-ft231x-13571-4787570.pdf?src-supplier=Mouser; ComponentLink3Description: https://datasheet.ciiva.com/4787/ds-ft231x-13571-4787570.pdf?src-supplier=Mouser; ComponentLink4URL: https://datasheet.ciiva.com/30475/0900766b811020d3-30475405.pdf?src-supplier=Rs; ComponentLink4Description: https://datasheet.ciiva.com/30475/0900766b811020d3-30475405.pdf?src-supplier=Rs; ComponentLink5URL: https://datasheet.ciiva.com/1787/ft-x-series-1787313.pdf?src-supplier=Digikey; ComponentLink5Description: https://datasheet.ciiva.com/1787/ft-x-series-1787313.pdf?src-supplier=Digikey; ComponentLink6URL: https://datasheet.ciiva.com/1787/ft-x-series-1787314.pdf?src-supplier=Digikey; ComponentLink6Description: https://datasheet.ciiva.com/1787/ft-x-series-1787314.pdf?src-supplier=Digikey; LCSC Part Number: C132159
U?#2 = TL1963A-33DCYR: Fixed Positive LDO Regulator, 3.3V, 0.55V Dropout, BIPolar, PDSO4, IC REG LIN 3.3V 1.5A SOT-223-4; Manufacturer: Texas Instruments; Package Body Material: Plastic; Dropout Voltage1-Max: 550mV; Dropout Voltage1-Nom: 340mV; Input Voltage Absolute-Max: 20V; Min Input Voltage: 3.8V; Channels: 1; Output Voltage1-Max: 3.4V; Output Voltage1-Min: 3.2V; Regulator Type: FIXED POSITIVE SINGLE OUTPUT LDO REGULATOR; Voltage Tolerance-Max: 3%; Qualification Status: Not Qualified; Supplier: Digikey; Supplier Part Number: 296-24897-1-ND; Manufacturer Part Number: TL1963A-33DCYR; RoHS: Yes; Category: Voltage Regulators - Linear; Stock: 4910; Pricing: 1=2,77, 10=2,069, 25=1,8936, 100=1,7, 250=1,60772, 500=1,55212, 1000=1,50634 (USD); Case/Package: SOP; Pins: 4; Package Shape: Rectangular; Terminal Finish: Tin; JESD-609 Code: e3; Adjustability: FIXED; Max Supply Voltage: 20V; JESD-30 Code: R-PDSO-G4; Moisture Sensitivity Level: 2; Number of Outputs: 1; Operating Temperature, TJ-Max: 125°C; Operating Temperature, TJ-Min: -40°C; Output Current1-Max: 1.5A; Output Voltage1-Nom: 3.3V; Packaging: Tape and Reel; Peak Reflow Temperature (Cel): 260°C; Surface Mount: Yes; Technology: BIPOLAR; Terminal Form: Gull Wing; Terminal Position: DUAL; Length: 6.5mm; Width: 3.5mm; Height - Seated (Max): 1.8mm; Terminal Pitch: 2.3mm; Reach SVHC Compliant: Yes; RoHS Compliant: Yes; ComponentLink1URL: https://www.ti.com:443/lit/ds/symlink/tl1963a.pdf?src-supplier=IHS+Markit; ComponentLink1Description: https://www.ti.com:443/lit/ds/symlink/tl1963a.pdf?src-supplier=IHS+Markit; ComponentLink2URL: https://datasheet.ciiva.com/2046/-2046068.pdf?src-supplier=Digikey; ComponentLink2Description: https://datasheet.ciiva.com/2046/-2046068.pdf?src-supplier=Digikey; LCSC Part Number: C181262
U?#3 = ESP32-S3-MINI-1-N8: SMD module, ESP32-S3FN8, 8 MB SPI flash, PCB antenna; Manufacturer: Espressif Systems; Supplier: Digikey; Supplier Part Number: 1965-ESP32-S3-MINI-1-N8DKR-ND; Manufacturer Part Number: ESP32-S3-MINI-1-N8; RoHS: No; Category: LDO; Stock: 12549; Pricing: 1=5,28, 10=4,566, 25=4,3196, 100=3,9802, 250=3,7768 (USD); ComponentLink1URL: https://datasheet.octopart.com/ESP32-S3-MINI-1-N8-Espressif-Systems-datasheet-165560562.pdf?src-supplier=TME; ComponentLink1Description: https://datasheet.octopart.com/ESP32-S3-MINI-1-N8-Espressif-Systems-datasheet-165560562.pdf?src-supplier=TME; LCSC Part Number: C2913206